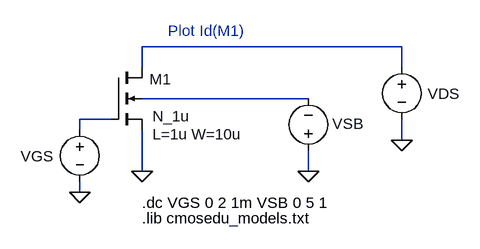
[diagram p0: schematic Fig6_13.asc]
Fig6_13.asc, the LTspice schematic file:
Version 4
SHEET 1 1048 680
WIRE 352 208 352 192
WIRE 352 304 352 288
WIRE 400 192 352 192
WIRE 448 112 448 80
WIRE 448 272 448 208
WIRE 704 160 448 160
WIRE 704 272 704 240
WIRE 848 80 448 80
WIRE 848 112 848 80
WIRE 848 224 848 192
FLAG 352 304 0
FLAG 448 272 0
FLAG 848 224 0
FLAG 704 272 0
SYMBOL nmos4 400 112 R0
WINDOW 0 59 18 Left 0
WINDOW 3 64 75 Left 0
WINDOW 123 64 103 Left 0
SYMATTR InstName M1
SYMATTR Value N_1u
SYMATTR Value2 L=1u W=10u
SYMBOL voltage 352 192 R0
WINDOW 0 -91 57 Left 0
WINDOW 3 24 104 Invisible 0
SYMATTR InstName VGS
SYMATTR Value 0
SYMBOL voltage 848 96 R0
WINDOW 123 0 0 Left 0
WINDOW 39 0 0 Left 0
WINDOW 0 40 57 Left 0
WINDOW 3 24 104 Invisible 0
SYMATTR InstName VDS
SYMATTR Value 5
SYMBOL voltage 704 256 R180
WINDOW 0 -37 57 Right 0
WINDOW 3 -49 27 Invisible 0
SYMATTR InstName VSB
SYMATTR Value 0
TEXT 448 320 Left 0 !.dc VGS 0 2 1m VSB 0 5 1
TEXT 448 344 Left 0 !.lib cmosedu_models.txt
TEXT 488 56 Left 0 ;Plot Id(M1)

The netlist it stands for:
* Fig6_13.asc
M1 N002 N001 0 N003 N_1u L=1u W=10u
VGS N001 0 0
VDS N002 0 5
VSB 0 N003 0
.model NMOS NMOS
.model PMOS PMOS
.lib standard.mos
.dc VGS 0 2 1m VSB 0 5 1
.lib cmosedu_models.txt
* Plot Id(M1)
.backanno
.end